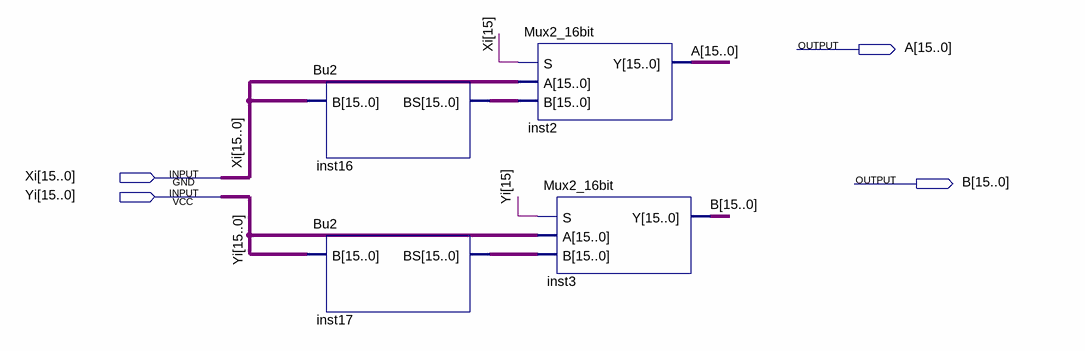
[diagram p0: schematic sheet]
// Quartus schematic DA_select.bdf as structural Verilog: 4 symbols, 4 pins
module DA_select (
  input  [15:0] Xi,
  input  [15:0] Yi,
  output [15:0] A,
  output [15:0] B
);

  wire [15:0] inst16_bs, inst17_bs;

  Bu2 inst16 (.B(Xi), .BS(inst16_bs));
  Bu2 inst17 (.B(Yi), .BS(inst17_bs));
  Mux2_16bit inst2 (.S(Xi[15]), .A(Xi), .B(inst16_bs), .Y(A));
  Mux2_16bit inst3 (.S(Yi[15]), .A(Yi), .B(inst17_bs), .Y(B));
endmodule
